# EAGLE schematic HomeSenseBasic (EAGLE 8.7.0)
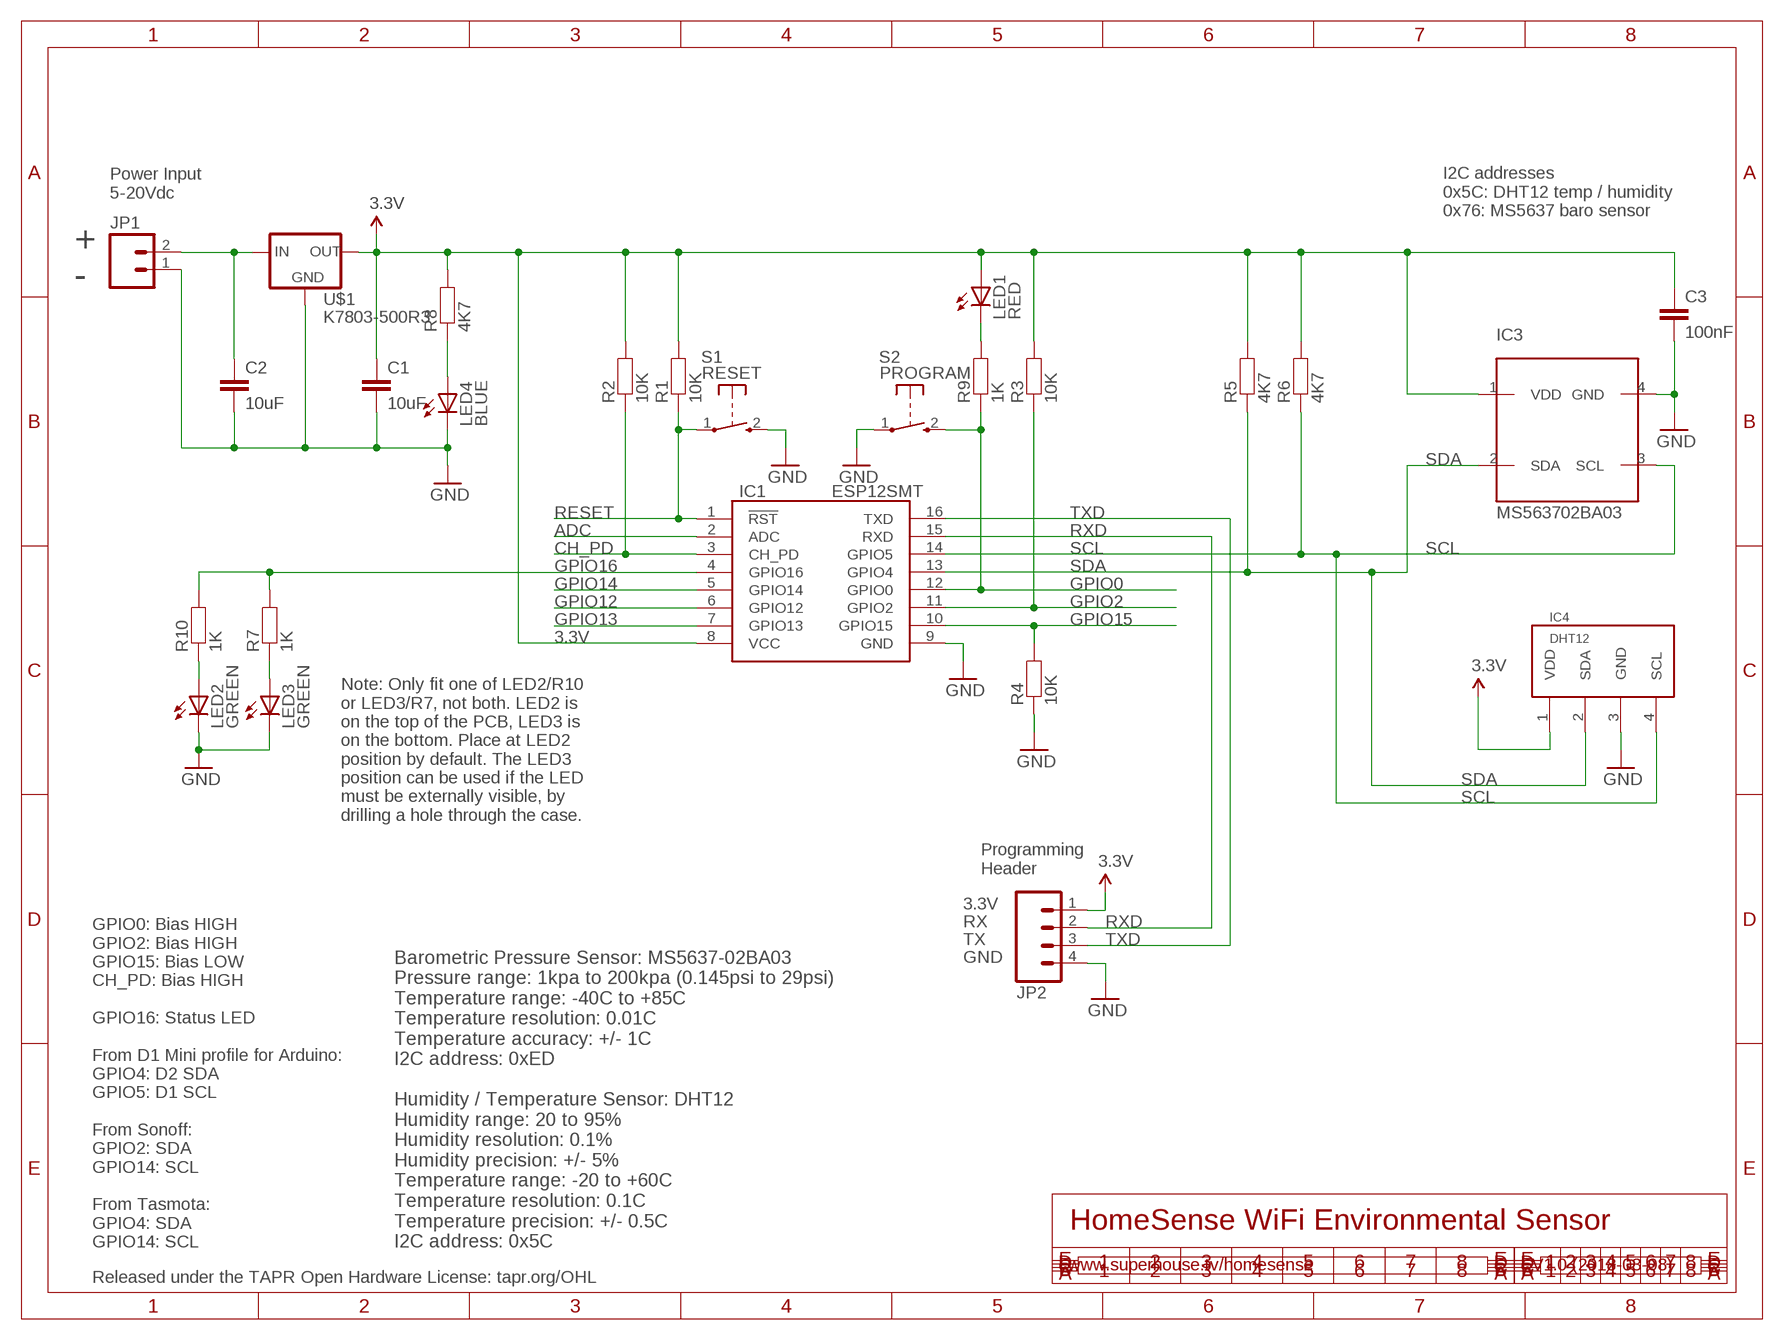
[diagram p0: schematic, sheet 1]

## Parts
C1  10uF  CAP0805  [0805]
C2  10uF  CAP0805  [0805]
C3  100nF  CAP0603  [0603]
IC1  ESP12SMT  [ESP12]
IC3  MS563702BA03  [MS5637]
IC4  DHT12  DHT12FLAT  [DHT12]
JP1  M02PTH  [1X02]
JP2  M04PTH  [1X04]
LED1  RED  LED0603  [LED-0603]
LED2  GREEN  LED0603  [LED-0603]
LED3  GREEN  LED0603  [LED-0603]
LED4  BLUE  LED0603  [LED-0603]
R1  10K  RESISTOR0603  [0603]
R2  10K  RESISTOR0603  [0603]
R3  10K  RESISTOR0603  [0603]
R4  10K  RESISTOR0603  [0603]
R5  4K7  RESISTOR0603  [0603]
R6  4K7  RESISTOR0603  [0603]
R7  1K  RESISTOR0603  [0603]
R8  4K7  RESISTOR0603  [0603]
R9  1K  RESISTOR0603  [0603]
R10  1K  RESISTOR0603  [0603]
S1  RESET  TAC_SWITCH_2PINSMT  [TACTILE_SWITCH_SMD_2PIN_TINY]
S2  PROGRAM  TAC_SWITCH_2PINSMT  [TACTILE_SWITCH_SMD_2PIN_TINY]
U$1  K7803-500R3  K78XX-500R3  [K78XX-500R3]

## Nets
3.3V: C1.1 C3.1 IC1.8(VCC) IC3.1(VDD) IC4.1(VDD) JP2.1 LED1.A R1.2 R2.2 R3.2 R5.2 R6.2 R8.2 U$1.3(OUT)
ADC: IC1.2(ADC)
CH_PD: IC1.3(CH_PD) R2.1
GND: C1.2 C2.2 C3.2 IC1.9(GND) IC3.4(GND) IC4.3(GND) JP1.1 JP2.4 LED2.C LED3.C LED4.C R4.1 S1.2(S) S2.1(P) U$1.2(GND)
GPIO0: IC1.12(GPIO0) R9.1 S2.2(S)
GPIO2: IC1.11(GPIO2) R3.1
GPIO12: IC1.6(GPIO12)
GPIO13: IC1.7(GPIO13)
GPIO14: IC1.5(GPIO14)
GPIO15: IC1.10(GPIO15) R4.2
GPIO16: IC1.4(GPIO16) R7.2 R10.2
N$1: C2.1 JP1.2 U$1.1(IN)
N$2: LED4.A R8.1
N$3: LED1.C R9.2
N$4: LED2.A R10.1
N$11: LED3.A R7.1
RESET: IC1.1(!RST) R1.1 S1.1(P)
RXD: IC1.15(RXD) JP2.2
SCL: IC1.14(GPIO5) IC3.3(SCL) IC4.4(SCL) R6.1
SDA: IC1.13(GPIO4) IC3.2(SDA) IC4.2(SDA) R5.1
TXD: IC1.16(TXD) JP2.3

## Notes on the sheet
- Power Input
  5-20Vdc
- I2C addresses
  0x5C: DHT12 temp / humidity
  0x76: MS5637 baro sensor
- +
- -
- Note: Only fit one of LED2/R10
  or LED3/R7, not both. LED2 is
  on the top of the PCB, LED3 is
  on the bottom. Place at LED2
  position by default. The LED3
  position can be used if the LED
  must be externally visible, by
  drilling a hole through the case.
- Programming
  Header
- 3.3V
- RX
- TX
- GND
- HomeSense WiFi Environmental Sensor
- GPIO0: Bias HIGH
  GPIO2: Bias HIGH
  GPIO15: Bias LOW
  CH_PD: Bias HIGH
  
  GPIO16: Status LED
  
  From D1 Mini profile for Arduino:
  GPIO4: D2 SDA
  GPIO5: D1 SCL
  
  From Sonoff:
  GPIO2: SDA
  GPIO14: SCL
  
  From Tasmota:
  GPIO4: SDA
  GPIO14: SCL
- Barometric Pressure Sensor: MS5637-02BA03
  Pressure range: 1kpa to 200kpa (0.145psi to 29psi)
  Temperature range: -40C to +85C
  Temperature resolution: 0.01C
  Temperature accuracy: +/- 1C
  I2C address: 0xED
  
  Humidity / Temperature Sensor: DHT12
  Humidity range: 20 to 95%
  Humidity resolution: 0.1%
  Humidity precision: +/- 5%
  Temperature range: -20 to +60C
  Temperature resolution: 0.1C
  Temperature precision: +/- 0.5C
  I2C address: 0x5C
- www.superhouse.tv/homesense | V1.0 (2018-03-08)
- Released under the TAPR Open Hardware License: tapr.org/OHL

## Library data of the parts
C1-C3 = freetronics-jon:CAP: Capacitor Standard 0603 ceramic capacitor, and 0.1" leaded capacitor.
IC1 = freetronics-jon:ESP12
IC3 = freetronics-jon:MS5637
IC4 = freetronics-jon:DHT12
JP1 = freetronics-jon:M02: Header 2 Standard 2-pin 0.1" header. Use with straight break away headers (SKU : PRT-00116), right angle break away headers (PRT-00553), swiss pins (PRT-00743), machine pins (PRT-00117), and female headers (PRT-00115). Molex polarized connector foot print use with SKU : PRT-08233 with associated crimp pins and housings.
JP2 = freetronics-jon:M04: Header 4 Standard 4-pin 0.1" header. Use with straight break away headers (SKU : PRT-00116), right angle break away headers (PRT-00553), swiss pins (PRT-00743), machine pins (PRT-00117), and female headers (PRT-00115). Molex polarized connector foot print use with SKU : PRT-08231 with associated crimp pins and housings. 1MM SMD Version SKU: PRT-10208
LED1-LED4 = freetronics-jon:LED: LEDs Standard schematic elements and footprints for 5mm, 3mm, 1206, and 0603 sized LEDs. 5mm - Spark Fun Electronics SKU : COM-00529 (and others)
R1-R10 = freetronics-jon:RESISTOR: Resistor Basic schematic elements and footprints for 0603, 1206, and PTH 1/10th watt (small) resistors.
S1 S2 = freetronics-jon:TAC_SWITCH_2PIN: Momentary Tactile Switch - 2 pin
U$1 = freetronics-jon:K78XX-500R3

## Net classes
0 default: width 0.203 mm, drill 0.356 mm, clearance 0.152 mm
1 power: width 0.203 mm, clearance 0.152 mm